# Altium schematic sheet [3] Power.SchDoc: Buck-Boost
size A3; Author: Caner ALP; CompanyName: ALP Electronics; DrawnBy: Caner Alp; Organization: ALP Electronics; Address1: Axel Oxenstiernas; Address2: Västerås; Address3: 72478; Address4: Sweden; DocumentNumber: 3; SheetNumber: 3; SheetTotal: 7
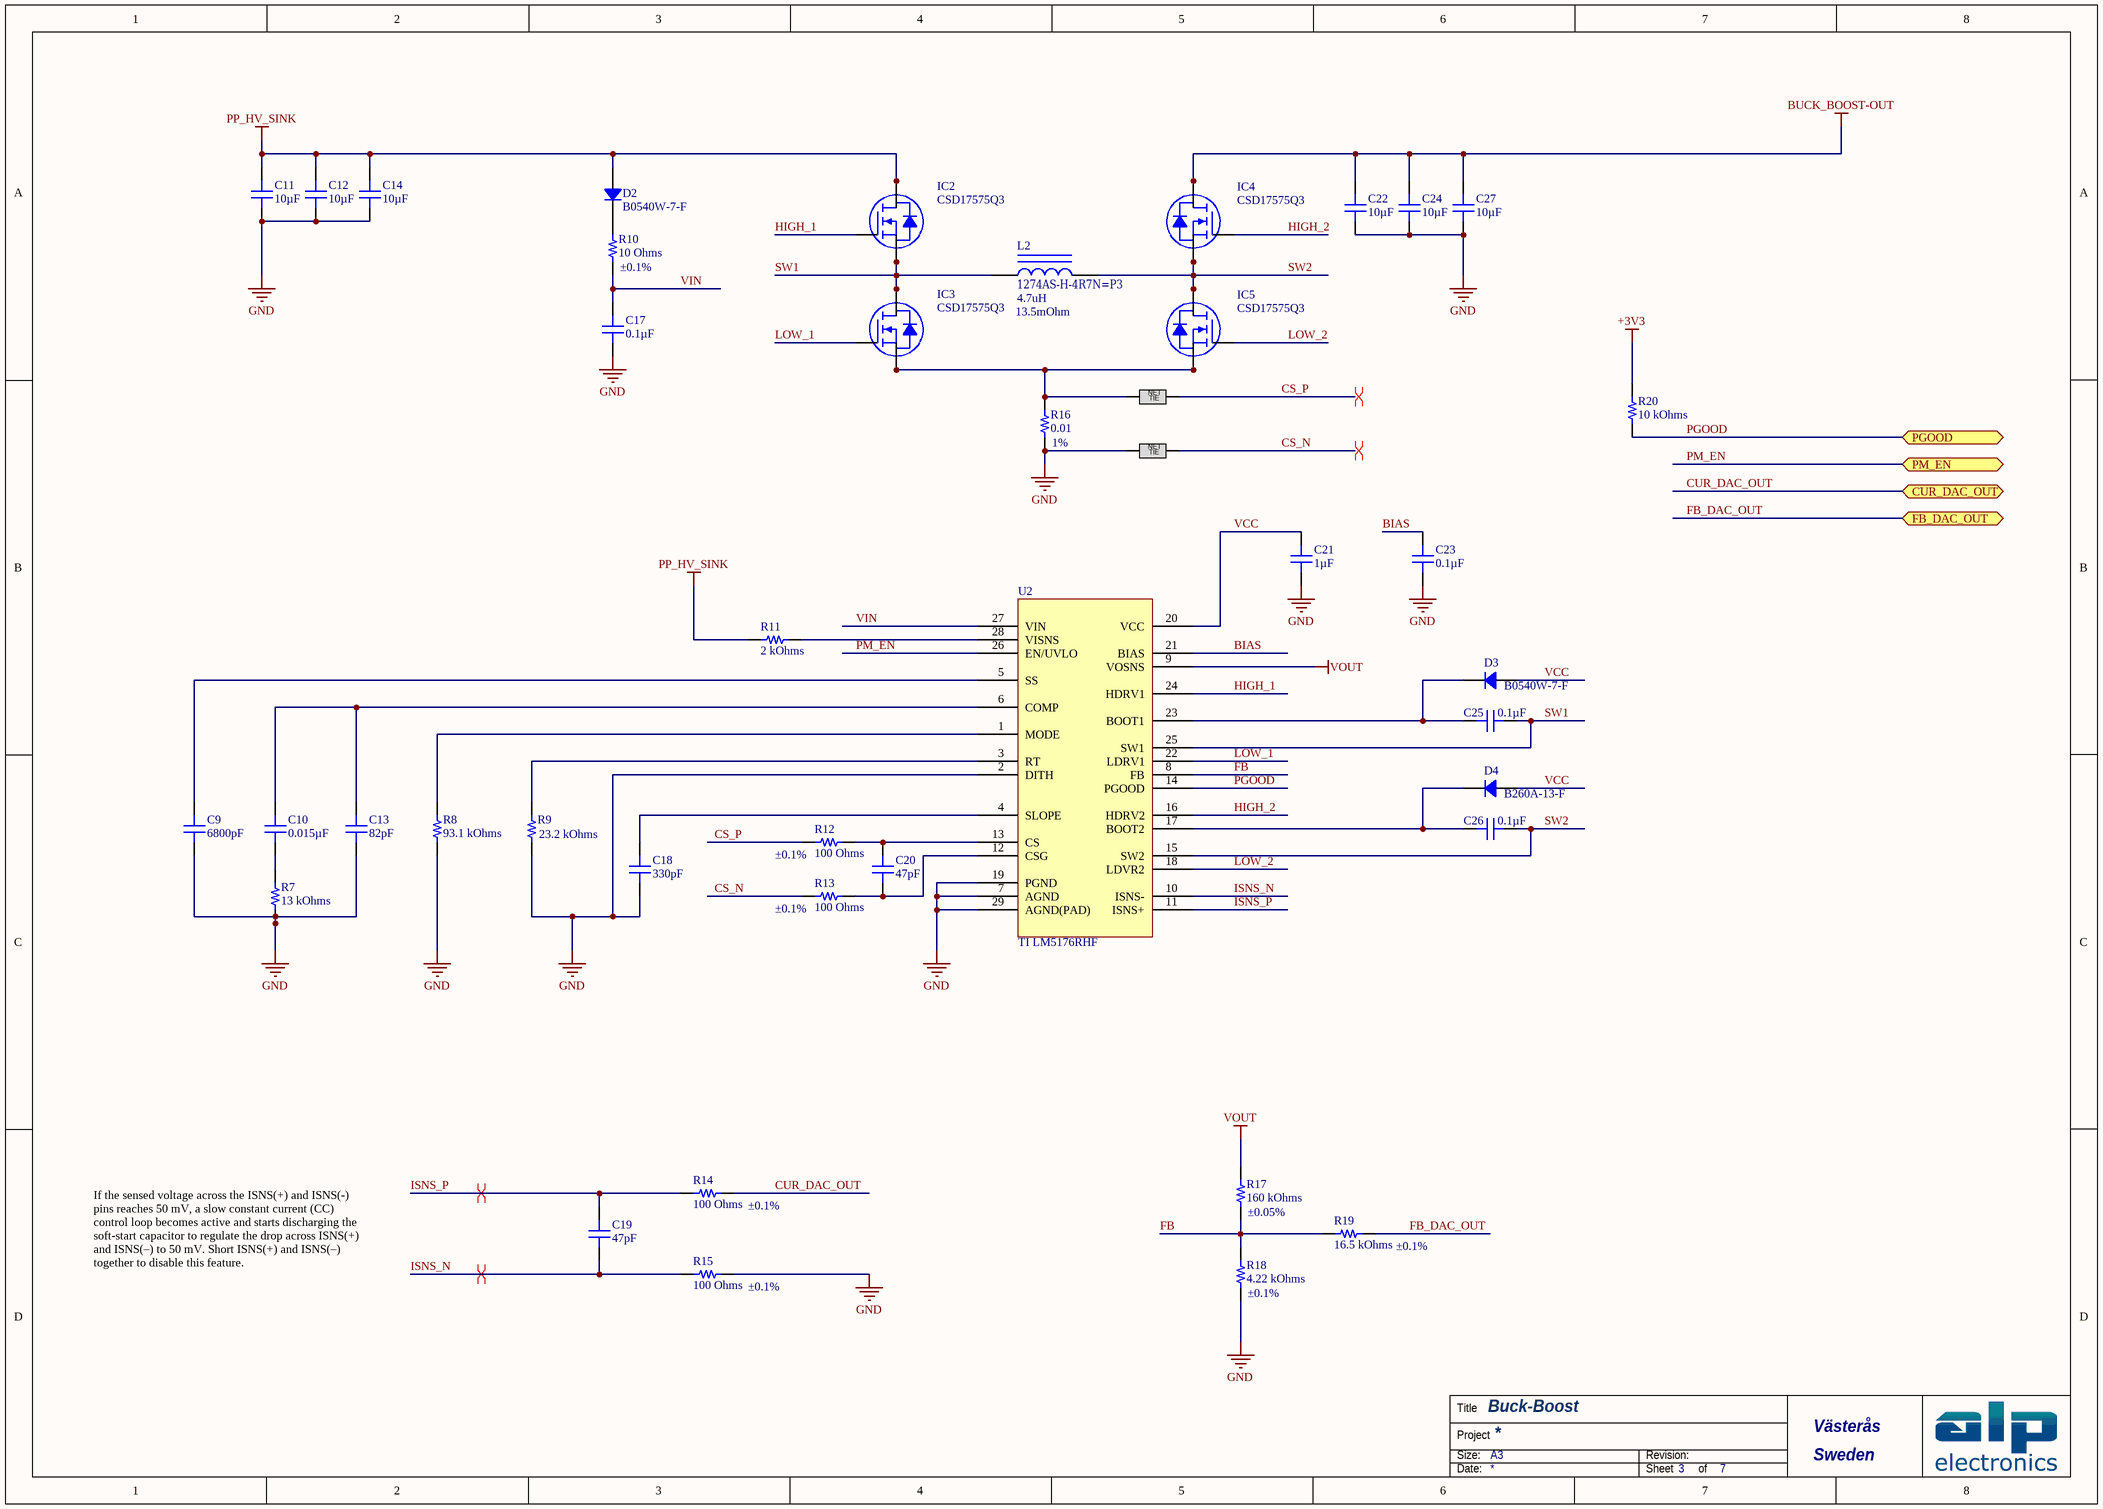
[diagram p0: [3] Power.SchDoc]

## Parts
C9  6800pF  [CAP 0603_1608]
C10  0.015µF  [CAP 0603_1608]
C11  10µF  [CAP 2220_5650 2.5MM]
C12  10µF  [CAP 2220_5650 2.5MM]
C13  82pF  [CAP 0603_1608]
C14  10µF  [CAP 2220_5650 2.5MM]
C17  0.1µF  [CAP 0603_1608]
C18  330pF  [CAP 0603_1608]
C19  47pF  [CAP 0603_1608]
C20  47pF  [CAP 0603_1608]
C21  1µF  [CAP 0603_1608]
C22  10µF  [CAP 2220_5650 2.5MM]
C23  0.1µF  [CAP 0603_1608]
C24  10µF  [CAP 2220_5650 2.5MM]
C25  0.1µF  [CAP 0603_1608]
C26  0.1µF  [CAP 0603_1608]
C27  10µF  [CAP 2220_5650 2.5MM]
D2  B0540W-7-F  [SOD-123]
D3  B0540W-7-F  [SOD-123]
D4  B260A-13-F  [DO214AC SMA]
IC2  CSD17575Q3  [TI SON-8 Q3]
IC3  CSD17575Q3  [TI SON-8 Q3]
IC4  CSD17575Q3  [TI SON-8 Q3]
IC5  CSD17575Q3  [TI SON-8 Q3]
L2  ‎1274AS-H-4R7N=P3‎  value 4.7uH  DCR: 13.5mOhm  [MURATA 1274AS]
NetTie1  Net Tie  [Net_Tie_2x0.156mm]  (value not drawn)  (net tie, no BOM)
NetTie2  Net Tie  [Net_Tie_2x0.156mm]  (value not drawn)  (net tie, no BOM)
R7  13 kOhms  [RES 0603_1608]
R8  93.1 kOhms  [RES 0603_1608]
R9  23.2 kOhms  [RES 0603_1608]
R10  Tolerance: ±0.1%  [RES 0603_1608]  (hidden comment: 10 Ohms)
R11  2 kOhms  [RES 0603_1608]
R12  Tolerance: ±0.1%  [RES 0603_1608]  (hidden comment: 100 Ohms)
R13  Tolerance: ±0.1%  [RES 0603_1608]  (hidden comment: 100 Ohms)
R14  Tolerance: ±0.1%  [RES 0603_1608]  (hidden comment: 100 Ohms)
R15  Tolerance: ±0.1%  [RES 0603_1608]  (hidden comment: 100 Ohms)
R16  0.01  Tolerance: 1%  [STACKPOLE CSR2512]
R17  Tolerance: ±0.05%  [RES 0603_1608]  (hidden comment: 160 kOhms)
R18  Tolerance: ±0.1%  [RES 0603_1608]  (hidden comment: 4.22 kOhms)
R19  Tolerance: ±0.1%  [RES 0603_1608]  (hidden comment: 16.5 kOhms)
R20  10 kOhms  [RES 0603_1608]
U2  TI LM5176RHF  [TI VQFN-28 RHF]

## Ports
CUR_DAC_OUT (bidir), FB_DAC_OUT (bidir), PGOOD (bidir), PM_EN (bidir)

## Nets
+3V3: R20.1
BUCK_BOOST-OUT: C22.2 C24.2 C27.2 IC4.5(D) IC4.6(D) IC4.7(D) IC4.8(D)
GND: C9.1 C11.1 C12.1 C13.1 C14.1 C17.2 C18.1 C21.1 C22.1 C23.1 C24.1 C27.1 NetTie2.1 R7.1 R8.1 R9.1 R15.2 R16.1 R18.1 U2.2(DITH) U2.7(AGND) U2.19(PGND) U2.29(AGND(PAD))
PP_HV_SINK: C11.2 C12.2 C14.2 D2.1 IC2.5(D) IC2.6(D) IC2.7(D) IC2.8(D) R11.1
VOUT: R17.2 U2.9(VOSNS)
BIAS: C23.2 U2.21(BIAS)
CS_N: NetTie2.2 R13.1
CS_P: NetTie1.2 R12.1
CUR_DAC_OUT: R14.2 ; port CUR_DAC_OUT
FB: R17.1 R18.2 R19.1 U2.8(FB)
FB_DAC_OUT: R19.2 ; port FB_DAC_OUT
HIGH_1: IC2.4(G) U2.24(HDRV1)
HIGH_2: IC4.4(G) U2.16(HDRV2)
ISNS_N: C19.1 R15.1 U2.10(ISNS-)
ISNS_P: C19.2 R14.1 U2.11(ISNS+)
LOW_1: IC3.4(G) U2.22(LDRV1)
LOW_2: IC5.4(G) U2.18(LDVR2)
PGOOD: R20.2 U2.14(PGOOD) ; port PGOOD
PM_EN: U2.26(EN/UVLO) ; port PM_EN
SW1: C25.1 IC2.1(S) IC2.2(S) IC2.3(S) IC3.5(D) IC3.6(D) IC3.7(D) IC3.8(D) L2.1 U2.25(SW1)
SW2: C26.1 IC4.1(S) IC4.2(S) IC4.3(S) IC5.5(D) IC5.6(D) IC5.7(D) IC5.8(D) L2.2 U2.15(SW2)
VCC: C21.2 D3.1 D4.1 U2.20(VCC)
VIN: C17.1 R10.1 U2.27(VIN)
NetC9_2: C9.2 U2.5(SS)
NetC10_1: C10.1 R7.2
NetC10_2: C10.2 C13.2 U2.6(COMP)
NetC18_2: C18.2 U2.4(SLOPE)
NetC20_1: C20.1 R13.2 U2.12(CSG)
NetC20_2: C20.2 R12.2 U2.13(CS)
NetC25_2: C25.2 D3.2 U2.23(BOOT1)
NetC26_2: C26.2 D4.2 U2.17(BOOT2)
NetD2_2: D2.2 R10.2
NetIC3_1: IC3.1(S) IC3.2(S) IC3.3(S) IC5.1(S) IC5.2(S) IC5.3(S) NetTie1.1 R16.2
NetR8_2: R8.2 U2.1(MODE)
NetR9_2: R9.2 U2.3(RT)
NetR11_2: R11.2 U2.28(VISNS)

## Layout directives
differential pair: CS_N, CS_P, ISNS_N, ISNS_P

## Notes on the sheet
- If the sensed voltage across the ISNS(+) and ISNS(-) pins reaches 50 mV, a slow constant current (CC) control loop becomes active and starts discharging the soft-start capacitor to regulate the drop across ISNS(+) and ISNS(–) to 50 mV. Short ISNS(+) and ISNS(–) together to disable this feature.
- Title
- Size:
- Project
- A3
- Revision:
- Date:
- Sheet
- of
- (in symbol Net Tie) NET; TIE

## Library data of the parts
C9 = 0603B682K500CT: CAP CER 6800PF 50V X7R 0603; Manufacturer: Walsin Technology Corporation; Tolerance: ±10%; Part Number: 0603B682K500CT; Value: 6800pF; Applications: General Purpose; Capacitance: 6800pF; ComponentLink1Description: Datasheet; ComponentLink1URL: http://www.passivecomponent.com/wp-content/uploads/2018/10/MLCC.pdf; ComponentLink2Description: DigiKey Link; ComponentLink2URL: http://digikey.com/product-detail/en/walsin-technology-corporation/0603B682K500CT/1292-1459-1-ND/9355463; Device Package: 0603 (1608 Metric); LastUpdated: 21/01/2020 00:01:43; Lifecycle Status: Active; Minimum Order: 1; Mounting Type: Surface Mount, MLCC; Operating Temperature: -55°C ~ 125°C; Package / Case: 0603 (1608 Metric); Packaging: TapeAndReel; PartId: 16042; Part Status: Active; Price: 0.01; Series: -; Size / Dimension: 0.063" L x 0.031" W (1.60mm x 0.80mm); Supplier 1: DigiKey; Supplier Part Number 1: 1292-1459-1-ND; Temperature Coefficient: X7R; Thickness (Max): 0.034" (0.87mm); Voltage - Rated: 50V
C10 = 0603B153K500CT: CAP CER 0.015UF 50V X7R 0603; Manufacturer: Walsin Technology Corporation; Tolerance: ±10%; Part Number: 0603B153K500CT; Value: 0.015µF; Applications: General Purpose; Capacitance: 0.015µF; ComponentLink1Description: Datasheet; ComponentLink1URL: http://www.passivecomponent.com/wp-content/uploads/2018/10/MLCC.pdf; ComponentLink2Description: DigiKey Link; ComponentLink2URL: http://digikey.com/product-detail/en/walsin-technology-corporation/0603B153K500CT/1292-1402-1-ND/9355406; Device Package: 0603 (1608 Metric); LastUpdated: 21/01/2020 00:01:57; Lifecycle Status: Active; Minimum Order: 1; Mounting Type: Surface Mount, MLCC; Operating Temperature: -55°C ~ 125°C; Package / Case: 0603 (1608 Metric); Packaging: TapeAndReel; PartId: 10009; Part Status: Active; Price: 0.01; Series: -; Size / Dimension: 0.063" L x 0.031" W (1.60mm x 0.80mm); Supplier 1: DigiKey; Supplier Part Number 1: 1292-1402-1-ND; Temperature Coefficient: X7R; Thickness (Max): 0.034" (0.87mm); Voltage - Rated: 50V
C11 C12 C14 C22 C24 C27 = C5750X7R1H106M230KB: CAP CER 10UF 50V X7R 2220; Manufacturer: TDK Corporation; Tolerance: ±20%; Part Number: C5750X7R1H106M230KB; Value: 10µF; Applications: General Purpose; Capacitance: 10µF; ComponentLink1Description: Datasheet; ComponentLink1URL: https://product.tdk.com/info/en/catalog/datasheets/mlcc_commercial_general_en.pdf?ref_disty=digikey; ComponentLink2Description: DigiKey Link; ComponentLink2URL: http://digikey.com/product-detail/en/tdk-corporation/C5750X7R1H106M230KB/445-1454-1-ND/569120; Device Package: 2220 (5750 Metric); LastUpdated: 21/01/2020 00:34:55; Lifecycle Status: Active; Minimum Order: 1; Mounting Type: Surface Mount, MLCC; Operating Temperature: -55°C ~ 125°C; Package / Case: 2220 (5750 Metric); Packaging: TapeAndReel; Part Status: Active; Price: 0.85; Series: C; Size / Dimension: 0.224" L x 0.197" W (5.70mm x 5.00mm); Supplier 1: DigiKey; Supplier Part Number 1: 445-1454-1-ND; Temperature Coefficient: X7R; Thickness (Max): 0.098" (2.50mm); Voltage - Rated: 50V
C13 = 06031A820GAT2A: CAP CER 82PF 100V C0G/NP0 0603; Manufacturer: AVX Corporation; Temperature Coefficient: C0G, NP0; Tolerance: ±2%; Part Number: 06031A820GAT2A; Value: 82pF; Applications: General Purpose; Capacitance: 82pF; ComponentLink1Description: Datasheet; ComponentLink1URL: http://datasheets.avx.com/C0GNP0-Dielectric.pdf; ComponentLink2Description: DigiKey Link; ComponentLink2URL: http://digikey.com/product-detail/en/avx-corporation/06031A820GAT2A/478-10796-1-ND/7536341; Device Package: 0603 (1608 Metric); LastUpdated: 21/01/2020 00:01:52; Lifecycle Status: Active; Minimum Order: 1; Mounting Type: Surface Mount, MLCC; Operating Temperature: -55°C ~ 125°C; Package / Case: 0603 (1608 Metric); Packaging: TapeAndReel; PartId: 13264; Part Status: Active; Price: 0.09; Series: -; Size / Dimension: 0.063" L x 0.032" W (1.60mm x 0.81mm); Supplier 1: DigiKey; Supplier Part Number 1: 478-10796-1-ND; Thickness (Max): 0.035" (0.90mm); Voltage - Rated: 100V
C17 C23 C25 C26 = 0603BB104K500NGT: CAP CER 0.1UF 50V X7R 0603; Manufacturer: Knowles Novacap; Tolerance: ±10%; Part Number: 0603BB104K500NGT; Value: 0.1µF; Applications: General Purpose; Capacitance: 0.1µF; ComponentLink1Description: Datasheet; ComponentLink1URL: https://www.knowlescapacitors.com/getattachment/6c8d48ef-fc2b-4752-ae2c-ce6c208de0c4/High-Capacitance-Chip.aspx; ComponentLink2Description: DigiKey Link; ComponentLink2URL: http://digikey.com/product-detail/en/knowles-novacap/0603BB104K500NGT/1763-1146-1-ND/7304094; Device Package: 0603 (1608 Metric); Features: Gold Flash Termination; LastUpdated: 21/01/2020 00:02:02; Lifecycle Status: Active; Minimum Order: 1; Mounting Type: Surface Mount, MLCC; Operating Temperature: -55°C ~ 125°C; Package / Case: 0603 (1608 Metric); Packaging: TapeAndReel; PartId: 7006; Part Status: Active; Price: 0.56; Series: -; Size / Dimension: 0.060" L x 0.030" W (1.52mm x 0.76mm); Supplier 1: DigiKey; Supplier Part Number 1: 1763-1146-1-ND; Temperature Coefficient: X7R; Thickness (Max): 0.035" (0.89mm); Voltage - Rated: 50V
C18 = 0603N331J101CT: CAP CER 330PF 100V C0G/NP0 0603; Manufacturer: Walsin Technology Corporation; Temperature Coefficient: C0G, NP0; Tolerance: ±5%; Part Number: 0603N331J101CT; Value: 330pF; Applications: General Purpose; Capacitance: 330pF; ComponentLink1Description: Datasheet; ComponentLink1URL: http://www.passivecomponent.com/wp-content/uploads/2018/10/MLCC.pdf; ComponentLink2Description: DigiKey Link; ComponentLink2URL: http://digikey.com/product-detail/en/walsin-technology-corporation/0603N331J101CT/1292-1519-1-ND/9355523; Device Package: 0603 (1608 Metric); LastUpdated: 21/01/2020 00:01:44; Lifecycle Status: Active; Minimum Order: 1; Mounting Type: Surface Mount, MLCC; Operating Temperature: -55°C ~ 125°C; Package / Case: 0603 (1608 Metric); Packaging: TapeAndReel; PartId: 15517; Part Status: Active; Price: 0.01; Series: -; Size / Dimension: 0.063" L x 0.031" W (1.60mm x 0.80mm); Supplier 1: DigiKey; Supplier Part Number 1: 1292-1519-1-ND; Thickness (Max): 0.034" (0.87mm); Voltage - Rated: 100V
C19 C20 = 500X14N470MV4T: CAP CER 47PF 50V C0G/NP0 0603; Manufacturer: Johanson Dielectrics Inc.; Temperature Coefficient: C0G, NP0; Tolerance: ±20%; Part Number: 500X14N470MV4T; Value: 47pF; Applications: Bypass, Decoupling; Capacitance: 47pF; ComponentLink1Description: Datasheet; ComponentLink1URL: https://www.johansondielectrics.com/downloads/x2y-filter-and-decoupling-capacitors.pdf; ComponentLink2Description: DigiKey Link; ComponentLink2URL: http://digikey.com/product-detail/en/johanson-dielectrics-inc/500X14N470MV4T/709-1003-1-ND/1556408; Device Package: 0603 (1608 Metric); Features: Low ESL (X2Y); LastUpdated: 21/01/2020 00:02:07; Lifecycle Status: Active; Minimum Order: 1; Mounting Type: Surface Mount, MLCC; Operating Temperature: -55°C ~ 125°C; Package / Case: 0603 (1608 Metric); Packaging: TapeAndReel; PartId: 4173; Part Status: Active; Price: 0.08; Series: X2Y®; Size / Dimension: 0.064" L x 0.035" W (1.63mm x 0.89mm); Supplier 1: DigiKey; Supplier Part Number 1: 709-1003-1-ND; Thickness (Max): 0.026" (0.66mm); Voltage - Rated: 50V
C21 = 06035C105KAT2A: CAP CER 1UF 50V X7R 0603; Manufacturer: AVX Corporation; Tolerance: ±10%; Part Number: 06035C105KAT2A; Value: 1µF; Applications: General Purpose; Capacitance: 1µF; ComponentLink1Description: Datasheet; ComponentLink1URL: http://datasheets.avx.com/X7RDielectric.pdf; ComponentLink2Description: DigiKey Link; ComponentLink2URL: http://digikey.com/product-detail/en/avx-corporation/06035C105KAT2A/478-10073-1-ND/6564295; Device Package: 0603 (1608 Metric); LastUpdated: 21/01/2020 00:02:08; Lifecycle Status: Active; Minimum Order: 1; Mounting Type: Surface Mount, MLCC; Operating Temperature: -55°C ~ 125°C; Package / Case: 0603 (1608 Metric); Packaging: TapeAndReel; PartId: 2905; Part Status: Active; Price: 0.15; Series: -; Size / Dimension: 0.063" L x 0.032" W (1.60mm x 0.81mm); Supplier 1: DigiKey; Supplier Part Number 1: 478-10073-1-ND; Temperature Coefficient: X7R; Thickness (Max): 0.020" (0.50mm); Voltage - Rated: 50V
D2 D3 = B0540W-7-F: DIODE SCHOTTKY 40V 500MA SOD123; Manufacturer: Diodes Incorporated; Current Reverse Leakage @ Vr: 20uA @ 40V; Voltage Forward (Vf): 510mV @ 500mA; Part Number: B0540W-7-F; PartId: 14601; Supplier 1: Digi-Key; Supplier Part Number 1: B0540W-FDITR-ND; ComponentLink1Description: Datasheet; ComponentLink1URL: http://www.diodes.com/_files/datasheets/ds30138.pdf; ComponentLink2Description: Digi-Key Listing; ComponentLink2URL: https://www.digikey.com/product-detail/en/diodes-incorporated/B0540W-7-F/B0540W-FDITR-ND/717688; Junction Operating Temperature: -65C ~ 150C; Price: 0.0644; Type: Schottky; Device Package: SOD-123; Voltage DC Reverse (Vr): 40V; Current Rectified: 500mA
D4 = B260A-13-F: DIODE SCHOTTKY 60V 2A SMA; Manufacturer: Diodes Incorporated; Current Reverse Leakage @ Vr: 500uA @ 60V; Voltage Forward (Vf): 700mV @ 2A; Part Number: B260A-13-F; PartId: 16325; Supplier 1: Digi-Key; Supplier Part Number 1: B260A-FDITR-ND; ComponentLink1Description: Datasheet; ComponentLink1URL: http://www.diodes.com/_files/datasheets/ds13004.pdf; ComponentLink2Description: Digi-Key Listing; ComponentLink2URL: https://www.digikey.com/product-detail/en/diodes-incorporated/B260A-13-F/B260A-FDITR-ND/750837; Junction Operating Temperature: -65C ~ 150C; Price: 0.0884; Type: Schottky; Device Package: DO-214AC, SMA; Voltage DC Reverse (Vr): 60V; Current Rectified: 2A
IC2-IC5 = CSD17308Q3T: MOSFET N-CH 30V 50A; Manufacturer: Texas Instruments; Rds On (Max) at Id, Vgs: 10.3 mOhm @ 10A, 8V; Vgs(th) (Max) at Id: 1.8V @ 250uA; Gate Charge (Qg): 5.1nC @ 4.5V; Input Capacitance (Ciss) at Vds: 700pF @ 15V; Power - Max: 2.7W; Current Continuous Drain: 50A (Ta), 44A (Tc); Part Number: CSD17308Q3T; PartId: 18050; Supplier 1: Digi-Key; Supplier Part Number 1: 296-44075-2-ND; ComponentLink1Description: Datasheet; ComponentLink1URL: http://www.ti.com/lit/ds/symlink/csd17308q3.pdf; ComponentLink2Description: Digi-Key Listing; ComponentLink2URL: https://www.digikey.com/product-detail/en/texas-instruments/CSD17308Q3T/296-44075-2-ND/5985436; Price: 0.8314; Type: MOSFET N-Channel, Metal Oxide; Device Package: 8-PowerTDFN; Drain to Source Voltage (Vdss): 30V; Features: Standard
L2 = Inductor Iron: Magnetic-Core Inductor; Published: 24-Mar-1999; LatestRevisionDate: 17-Jul-2002; LatestRevisionNote: Re-released for DXP Platform.; PackageReference: AXIAL-0.9; Publisher: Altium Limited; PackageDescription: Axial Device, Thru-Hole; 2 Leads; 0.9 in Pin Spacing
R7 = ERJ-PB3D1302V: RES SMD 13K OHM 0.5% 1/5W 0603; Manufacturer: Panasonic Electronic Components; Power (Watts): 0.2W, 1/5W; Temperature Coefficient: ±50ppm/°C; Part Number: ERJ-PB3D1302V; Value: 13 kOhms; ComponentLink1Description: Datasheet; ComponentLink1URL: https://industrial.panasonic.com/cdbs/www-data/pdf/RDM0000/AOA0000C328.pdf; ComponentLink2Description: DigiKey Link; ComponentLink2URL: http://digikey.com/product-detail/en/panasonic-electronic-components/ERJ-PB3D1302V/P20409CT-ND/6214664; Composition: Thick Film; Device Package: 0603 (1608 Metric); Features: Automotive AEC-Q200, Pulse Withstanding; Height - Seated (Max): 0.022" (0.55mm); LastUpdated: 21/01/2020 00:18:56; Lifecycle Status: Active; Minimum Order: 1; Number of Terminations: 2; Operating Temperature: -55°C ~ 155°C; Package / Case: 0603 (1608 Metric); Packaging: TapeAndReel; PartId: 19636; Part Status: Active; Price: 0.02; Ratings: AEC-Q200; Resistance: 13 kOhms; Series: ERJ; Size / Dimension: 0.063" L x 0.031" W (1.60mm x 0.80mm); Supplier 1: DigiKey; Supplier Part Number 1: P20409CT-ND; Supplier Device Package: 0603; Tolerance: ±0.5%
R8 = ERJ-PB3D9312V: RES SMD 93.1K OHM 0.5% 1/5W 0603; Manufacturer: Panasonic Electronic Components; Power (Watts): 0.2W, 1/5W; Temperature Coefficient: ±50ppm/°C; Part Number: ERJ-PB3D9312V; Value: 93.1 kOhms; ComponentLink1Description: Datasheet; ComponentLink1URL: https://industrial.panasonic.com/cdbs/www-data/pdf/RDM0000/AOA0000C328.pdf; ComponentLink2Description: DigiKey Link; ComponentLink2URL: http://digikey.com/product-detail/en/panasonic-electronic-components/ERJ-PB3D9312V/P20508CT-ND/6214763; Composition: Thick Film; Device Package: 0603 (1608 Metric); Features: Automotive AEC-Q200, Pulse Withstanding; Height - Seated (Max): 0.022" (0.55mm); LastUpdated: 21/01/2020 00:24:15; Lifecycle Status: Active; Minimum Order: 1; Number of Terminations: 2; Operating Temperature: -55°C ~ 155°C; Package / Case: 0603 (1608 Metric); Packaging: TapeAndReel; PartId: 6686; Part Status: Active; Price: 0.02; Ratings: AEC-Q200; Resistance: 93.1 kOhms; Series: ERJ; Size / Dimension: 0.063" L x 0.031" W (1.60mm x 0.80mm); Supplier 1: DigiKey; Supplier Part Number 1: P20508CT-ND; Supplier Device Package: 0603; Tolerance: ±0.5%
R9 = RNCF0603DTE23K2: RES 23.2K OHM 0.5% 1/10W 0603; Manufacturer: Stackpole Electronics Inc; Power (Watts): 0.1W, 1/10W; Temperature Coefficient: ±25ppm/°C; Part Number: RNCF0603DTE23K2; Value: 23.2 kOhms; ComponentLink1Description: Datasheet; ComponentLink1URL: https://www.seielect.com/catalog/sei-rncf.pdf; ComponentLink2Description: DigiKey Link; ComponentLink2URL: http://digikey.com/product-detail/en/stackpole-electronics-inc/RNCF0603DTE23K2/RNCF0603DTE23K2CT-ND/9915119; Composition: Thin Film; Device Package: 0603 (1608 Metric); Features: Automotive AEC-Q200; Height - Seated (Max): 0.022" (0.55mm); LastUpdated: 21/01/2020 00:24:44; Lifecycle Status: Active; Minimum Order: 1; Number of Terminations: 2; Operating Temperature: -55°C ~ 155°C; Package / Case: 0603 (1608 Metric); Packaging: TapeAndReel; PartId: 5426; Part Status: Active; Price: 0.02; Ratings: AEC-Q200; Resistance: 23.2 kOhms; Series: RNCF; Size / Dimension: 0.061" L x 0.031" W (1.55mm x 0.80mm); Supplier 1: DigiKey; Supplier Part Number 1: RNCF0603DTE23K2CT-ND; Supplier Device Package: 0603; Tolerance: ±0.5%
R10 = RT0603BRD0710RL: RES SMD 10 OHM 0.1% 1/10W 0603; Manufacturer: Yageo; Power (Watts): 0.1W, 1/10W; Temperature Coefficient: ±25ppm/°C; Part Number: RT0603BRD0710RL; Value: 10 Ohms; ComponentLink1Description: Datasheet; ComponentLink1URL: https://www.yageo.com/upload/media/product/productsearch/datasheet/rchip/PYu-RT_1-to-0.01_RoHS_L_11.pdf; ComponentLink2Description: DigiKey Link; ComponentLink2URL: http://digikey.com/product-detail/en/yageo/RT0603BRD0710RL/YAG3350CT-ND/5418055; Composition: Thin Film; Device Package: 0603 (1608 Metric); Height - Seated (Max): 0.022" (0.55mm); LastUpdated: 21/01/2020 00:22:54; Lifecycle Status: Active; Minimum Order: 1; Number of Terminations: 2; Operating Temperature: -55°C ~ 155°C; Package / Case: 0603 (1608 Metric); Packaging: TapeAndReel; PartId: 10161; Part Status: Active; Price: 0.05; Resistance: 10 Ohms; Series: RT; Size / Dimension: 0.063" L x 0.031" W (1.60mm x 0.80mm); Supplier 1: DigiKey; Supplier Part Number 1: YAG3350CT-ND; Supplier Device Package: 0603
R11 = CR0603-JW-202ELF: RES SMD 2K OHM 5% 1/10W 0603; Manufacturer: Bourns Inc.; Power (Watts): 0.1W, 1/10W; Temperature Coefficient: ±200ppm/°C; Part Number: CR0603-JW-202ELF; Value: 2 kOhms; ComponentLink1Description: Datasheet; ComponentLink1URL: https://www.bourns.com/docs/Product-Datasheets/CHPREZTR.pdf; ComponentLink2Description: DigiKey Link; ComponentLink2URL: http://digikey.com/product-detail/en/bourns-inc/CR0603-JW-202ELF/CR0603-JW-202ELFCT-ND/3925347; Composition: Thick Film; Device Package: 0603 (1608 Metric); Features: Moisture Resistant; Height - Seated (Max): 0.022" (0.55mm); LastUpdated: 21/01/2020 00:24:32; Lifecycle Status: Active; Minimum Order: 1; Number of Terminations: 2; Operating Temperature: -55°C ~ 155°C; Package / Case: 0603 (1608 Metric); Packaging: CutTape; PartId: 5980; Part Status: Active; Price: 0.10; Resistance: 2 kOhms; Series: CR0603; Size / Dimension: 0.063" L x 0.031" W (1.60mm x 0.80mm); Supplier 1: DigiKey; Supplier Part Number 1: CR0603-JW-202ELFCT-ND; Supplier Device Package: 0603; Tolerance: ±5%
R12-R15 = RNCS0603BKE100R: RES 100 OHM 0.1% 1/16W 0603; Manufacturer: Stackpole Electronics Inc; Power (Watts): 0.063W, 1/16W; Temperature Coefficient: ±25ppm/°C; Part Number: RNCS0603BKE100R; Value: 100 Ohms; ComponentLink1Description: Datasheet; ComponentLink1URL: https://www.seielect.com/catalog/sei-rncs_rnch.pdf; ComponentLink2Description: DigiKey Link; ComponentLink2URL: http://digikey.com/product-detail/en/stackpole-electronics-inc/RNCS0603BKE100R/RNCS0603BKE100RCT-ND/1800117; Composition: Thin Film; Device Package: 0603 (1608 Metric); Features: Anti-Corrosive, Automotive AEC-Q200, Moisture Resistant; Height - Seated (Max): 0.022" (0.55mm); LastUpdated: 21/01/2020 00:25:01; Lifecycle Status: Active; Minimum Order: 1; Number of Terminations: 2; Operating Temperature: -55°C ~ 155°C; Package / Case: 0603 (1608 Metric); Packaging: TapeAndReel; PartId: 4839; Part Status: Active; Price: 0.08; Ratings: AEC-Q200; Resistance: 100 Ohms; Series: RNCS; Size / Dimension: 0.061" L x 0.031" W (1.55mm x 0.80mm); Supplier 1: DigiKey; Supplier Part Number 1: RNCS0603BKE100RCT-ND; Supplier Device Package: 0603
R16 = CSR2512FK10L0: RES SMD 0.01 OHM 1% 2W 2512; Manufacturer: Stackpole Electronics Inc.; TemperatureRange: -55C ~ 155C; TemperatureCoefficient: 200ppm/C; Value: 0.01; Part Number: CSR2512FK10L0; PartId: 10090; Supplier 1: Digi-Key; Supplier Part Number 1: CSR2512FK10L0-ND; ComponentLink1Description: Datasheet; ComponentLink1URL: http://www.seielect.com/catalog/SEI-CSR_CSRN.pdf; ComponentLink2Description: Digi-Key Listing; ComponentLink2URL: https://www.digikey.com/product-detail/en/stackpole-electronics-inc/CSR2512FK10L0/CSR2512FK10L0-ND/1742503; PowerRating: 2W; Price: 0.22; Device Package: 2512 (6432 Metric)
R17 = RG1608N-164-W-T1: RES SMD 160KOHM 0.05% 1/10W 0603; Manufacturer: Susumu; Power (Watts): 0.1W, 1/10W; Temperature Coefficient: ±10ppm/°C; Part Number: RG1608N-164-W-T1; Value: 160 kOhms; ComponentLink1Description: Datasheet; ComponentLink1URL: //media.digikey.com/pdf/Data%20Sheets/Susumu%20PDFs/RG_RM_RGH_Oct2012.pdf; ComponentLink2Description: DigiKey Link; ComponentLink2URL: http://digikey.com/product-detail/en/susumu/RG1608N-164-W-T1/408-1681-1-ND/600838; Composition: Thin Film; Device Package: 0603 (1608 Metric); Features: Anti-Sulfur, Automotive AEC-Q200; Height - Seated (Max): 0.020" (0.50mm); LastUpdated: 21/01/2020 00:21:03; Lifecycle Status: Active; Minimum Order: 1; Number of Terminations: 2; Operating Temperature: -55°C ~ 155°C; Package / Case: 0603 (1608 Metric); Packaging: TapeAndReel; PartId: 14646; Part Status: Active; Price: 0.30; Ratings: AEC-Q200; Resistance: 160 kOhms; Series: RG; Size / Dimension: 0.063" L x 0.031" W (1.60mm x 0.80mm); Supplier 1: DigiKey; Supplier Part Number 1: 408-1681-1-ND; Supplier Device Package: 0603
R18 = ERJ-PB3B4221V: RES SMD 4.22K OHM 0.1% 1/5W 0603; Manufacturer: Panasonic Electronic Components; Power (Watts): 0.2W, 1/5W; Temperature Coefficient: ±50ppm/°C; Part Number: ERJ-PB3B4221V; Value: 4.22 kOhms; ComponentLink1Description: Datasheet; ComponentLink1URL: https://industrial.panasonic.com/cdbs/www-data/pdf/RDM0000/AOA0000C328.pdf; ComponentLink2Description: DigiKey Link; ComponentLink2URL: http://digikey.com/product-detail/en/panasonic-electronic-components/ERJ-PB3B4221V/P20042CT-ND/6214297; Composition: Thick Film; Device Package: 0603 (1608 Metric); Features: Automotive AEC-Q200, Pulse Withstanding; Height - Seated (Max): 0.022" (0.55mm); LastUpdated: 21/01/2020 00:23:17; Lifecycle Status: Active; Minimum Order: 1; Number of Terminations: 2; Operating Temperature: -55°C ~ 155°C; Package / Case: 0603 (1608 Metric); Packaging: TapeAndReel; PartId: 9111; Part Status: Active; Price: 0.03; Ratings: AEC-Q200; Resistance: 4.22 kOhms; Series: ERJ; Size / Dimension: 0.063" L x 0.031" W (1.60mm x 0.80mm); Supplier 1: DigiKey; Supplier Part Number 1: P20042CT-ND; Supplier Device Package: 0603
R19 = ERA-3AEB1652V: RES SMD 16.5KOHM 0.1% 1/10W 0603; Manufacturer: Panasonic Electronic Components; Power (Watts): 0.1W, 1/10W; Temperature Coefficient: ±25ppm/°C; Part Number: ERA-3AEB1652V; Value: 16.5 kOhms; ComponentLink1Description: Datasheet; ComponentLink1URL: https://industrial.panasonic.com/cdbs/www-data/pdf/RDM0000/AOA0000C307.pdf; ComponentLink2Description: DigiKey Link; ComponentLink2URL: http://digikey.com/product-detail/en/panasonic-electronic-components/ERA-3AEB1652V/P16.5KDBCT-ND/3075821; Composition: Thin Film; Device Package: 0603 (1608 Metric); Features: Automotive AEC-Q200; Height - Seated (Max): 0.022" (0.55mm); LastUpdated: 21/01/2020 00:15:50; Lifecycle Status: Active; Minimum Order: 1; Number of Terminations: 2; Operating Temperature: -55°C ~ 155°C; Package / Case: 0603 (1608 Metric); Packaging: TapeAndReel; PartId: 24776; Part Status: Active; Price: 0.04; Ratings: AEC-Q200; Resistance: 16.5 kOhms; Series: ERA-3A; Size / Dimension: 0.063" L x 0.031" W (1.60mm x 0.80mm); Supplier 1: DigiKey; Supplier Part Number 1: P16.5KDBCT-ND; Supplier Device Package: 0603
R20 = CRCW060310K0JNEA: RES SMD 10K OHM 5% 1/10W 0603; Manufacturer: Vishay Dale; Power (Watts): 0.1W, 1/10W; Temperature Coefficient: ±200ppm/°C; Part Number: CRCW060310K0JNEA; Value: 10 kOhms; ComponentLink1Description: Datasheet; ComponentLink1URL: http://www.vishay.com/docs/20035/dcrcwe3.pdf; ComponentLink2Description: DigiKey Link; ComponentLink2URL: http://digikey.com/product-detail/en/vishay-dale/CRCW060310K0JNEA/541-10KGCT-ND/1179393; Composition: Thick Film; Device Package: 0603 (1608 Metric); Features: Automotive AEC-Q200; Height - Seated (Max): 0.020" (0.50mm); LastUpdated: 21/01/2020 00:24:50; Lifecycle Status: Active; Minimum Order: 1; Number of Terminations: 2; Operating Temperature: -55°C ~ 155°C; Package / Case: 0603 (1608 Metric); Packaging: CutTape; PartId: 5216; Part Status: Active; Price: 0.10; Ratings: AEC-Q200; Resistance: 10 kOhms; Series: CRCW; Size / Dimension: 0.063" L x 0.033" W (1.60mm x 0.85mm); Supplier 1: DigiKey; Supplier Part Number 1: 541-10KGCT-ND; Supplier Device Package: 0603; Tolerance: ±5%
U2 = TI LM5176RHF: 55-V Wide VIN synchronous 4-switch buck-boost controller